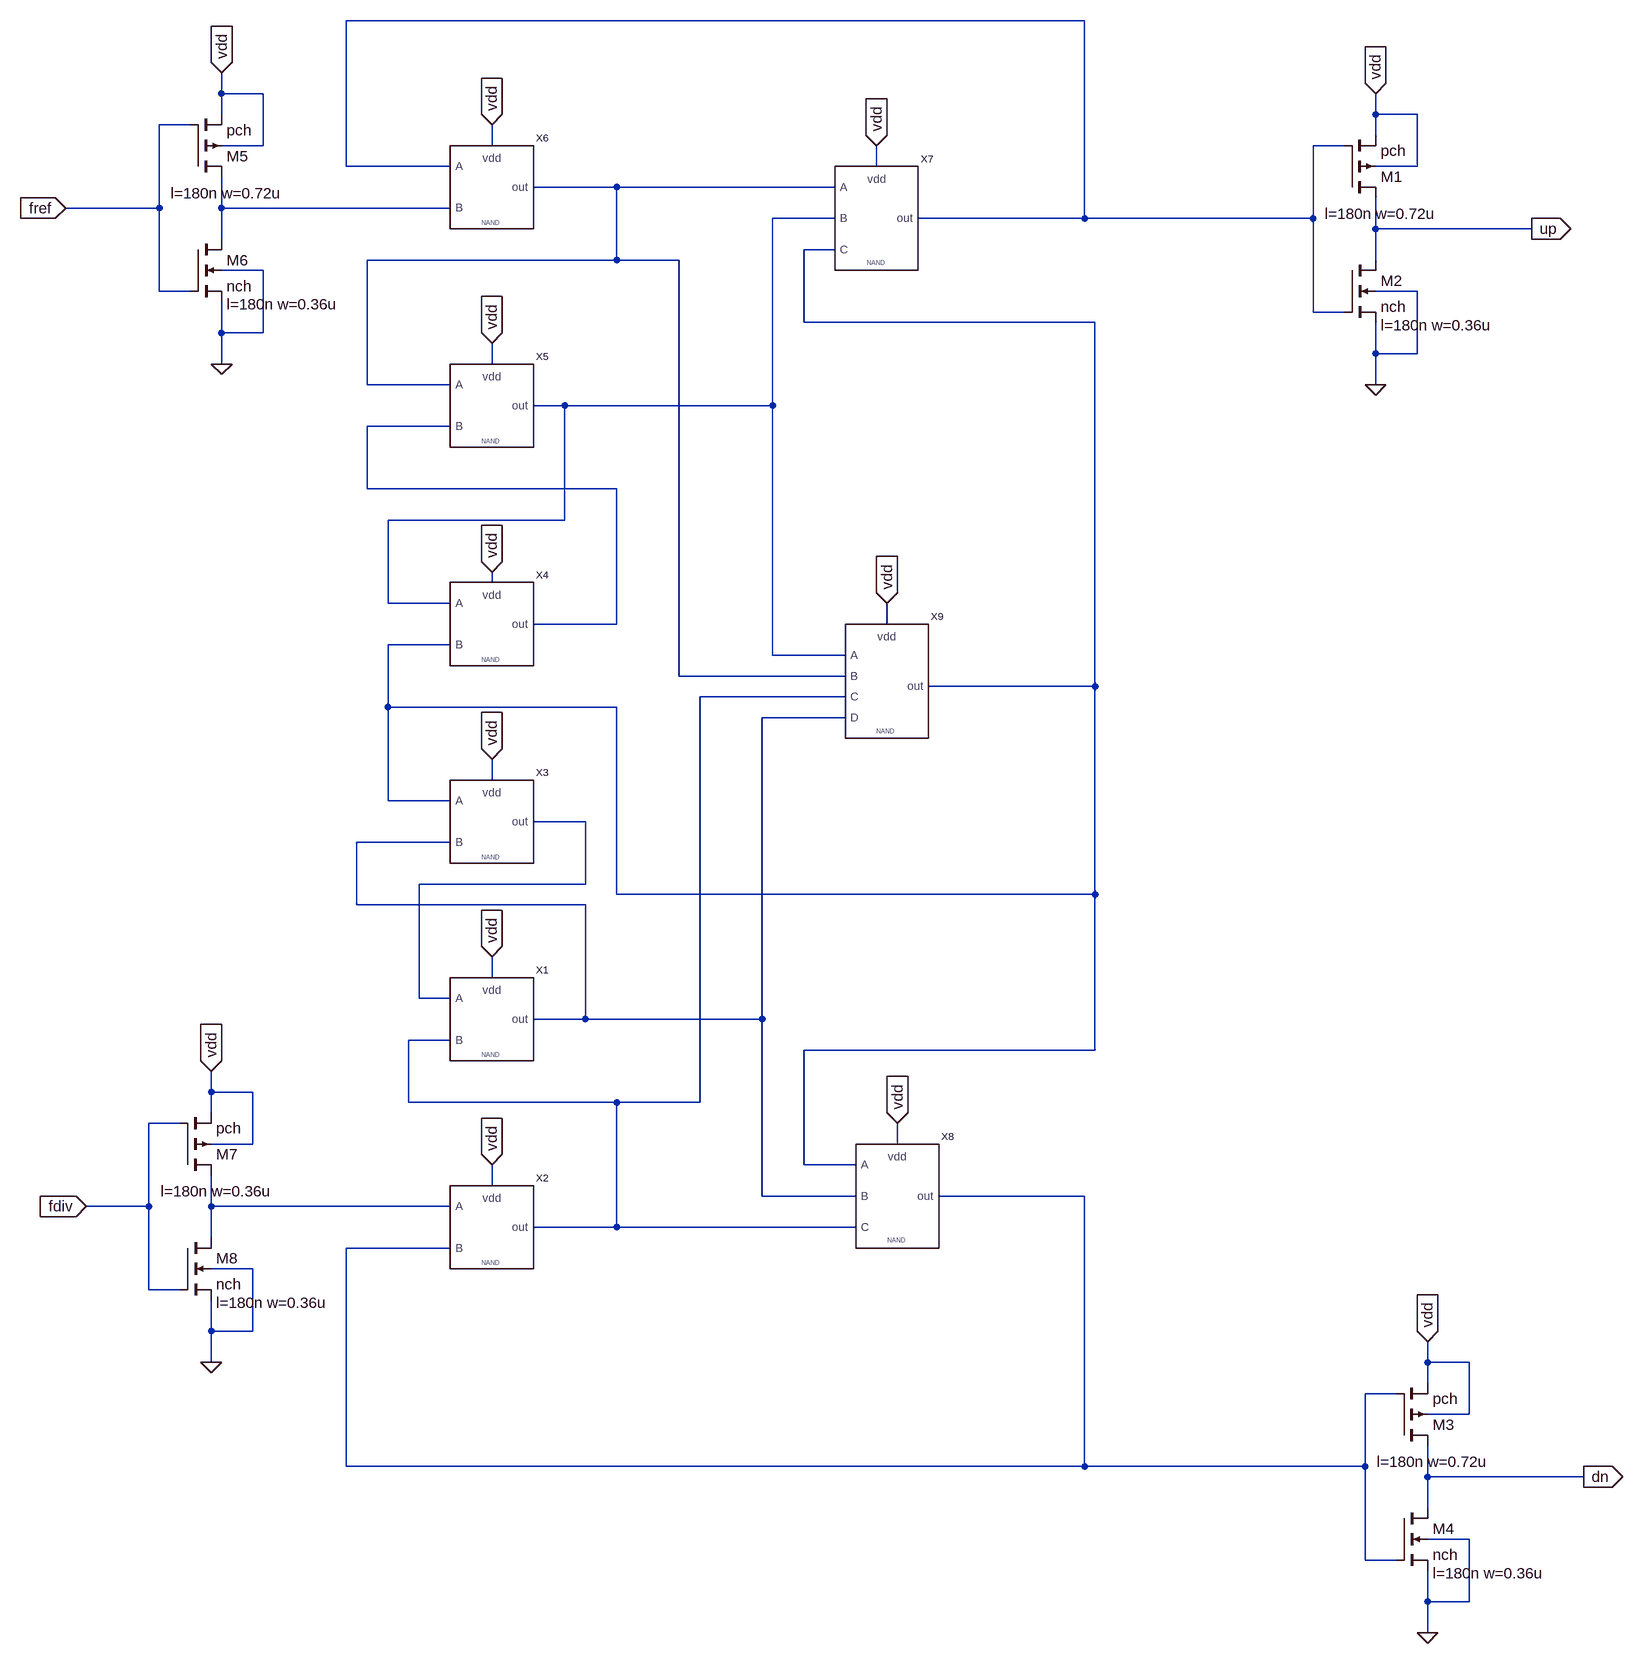
[diagram p0: schematic PFD_NAND.asc]
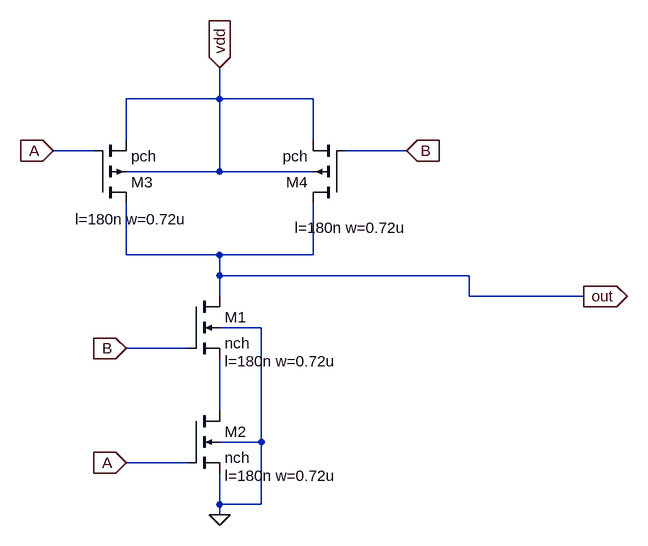
[diagram p1: sub-circuit nand_2.asc]
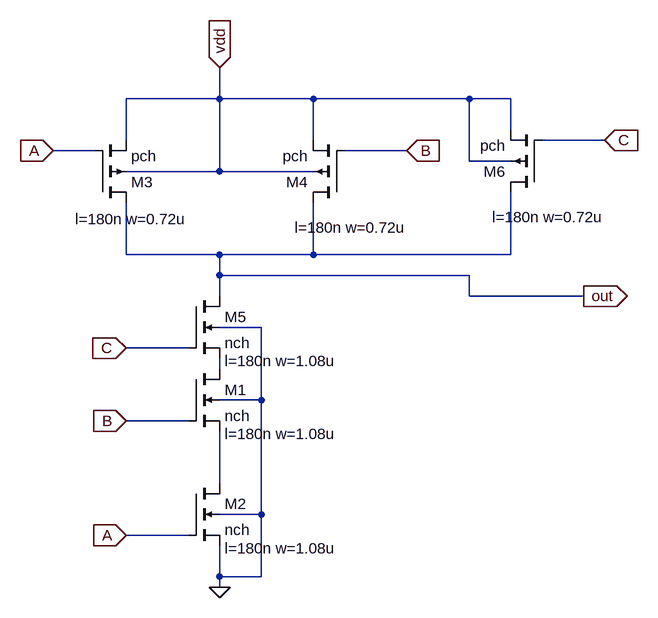
[diagram p2: sub-circuit nand_3.asc]
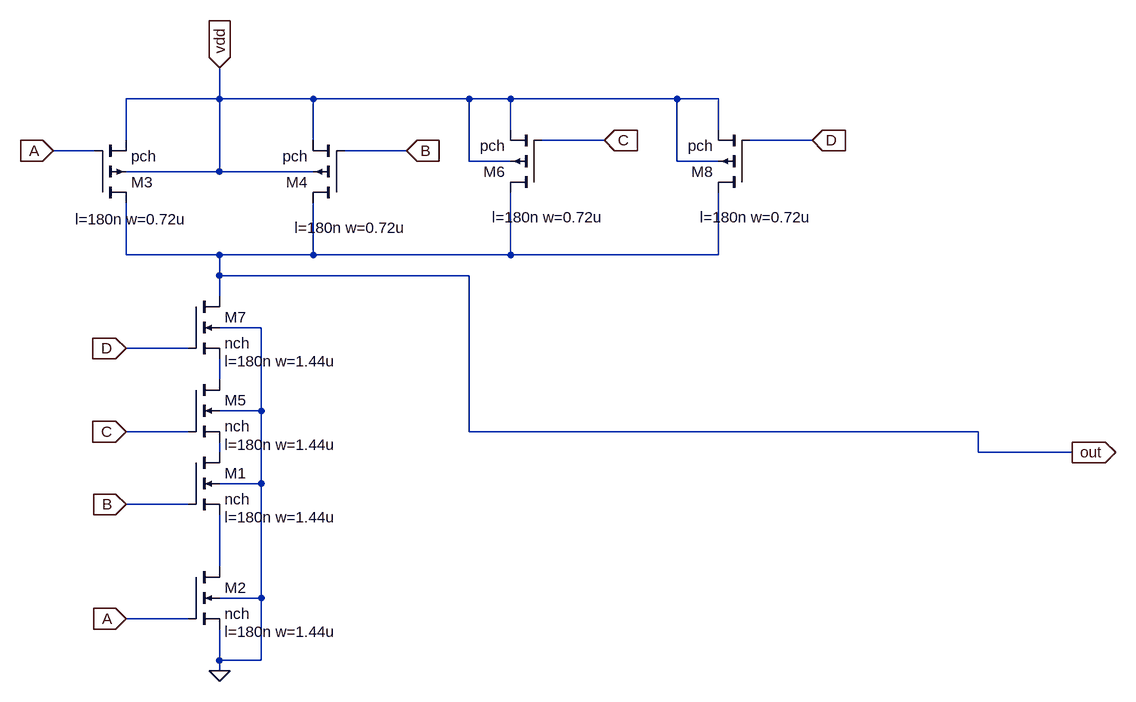
[diagram p3: sub-circuit nand_4.asc]
PFD_NAND.asc, the LTspice schematic file:
Version 4
SHEET 1 1908 1336
WIRE 1040 -1168 -96 -1168
WIRE -288 -1056 -288 -1088
WIRE -224 -1056 -288 -1056
WIRE -288 -1024 -288 -1056
WIRE 1488 -1024 1488 -1056
WIRE 1552 -1024 1488 -1024
WIRE -336 -1008 -384 -1008
WIRE 1488 -992 1488 -1024
WIRE -224 -976 -224 -1056
WIRE -224 -976 -288 -976
WIRE 128 -976 128 -1008
WIRE 1440 -976 1392 -976
WIRE -96 -944 -96 -1168
WIRE 64 -944 -96 -944
WIRE 720 -944 720 -976
WIRE 1552 -944 1552 -1024
WIRE 1552 -944 1488 -944
WIRE 320 -912 192 -912
WIRE 656 -912 320 -912
WIRE -384 -880 -384 -1008
WIRE -384 -880 -528 -880
WIRE -288 -880 -288 -928
WIRE 64 -880 -288 -880
WIRE 656 -864 560 -864
WIRE 1040 -864 1040 -1168
WIRE 1040 -864 784 -864
WIRE 1392 -864 1392 -976
WIRE 1392 -864 1040 -864
WIRE 1488 -848 1488 -896
WIRE 1728 -848 1488 -848
WIRE -288 -832 -288 -880
WIRE 656 -816 608 -816
WIRE 320 -800 320 -912
WIRE 320 -800 -64 -800
WIRE 416 -800 320 -800
WIRE 1488 -800 1488 -848
WIRE -224 -784 -288 -784
WIRE -384 -752 -384 -880
WIRE -336 -752 -384 -752
WIRE 1552 -752 1488 -752
WIRE 1392 -720 1392 -864
WIRE 1440 -720 1392 -720
WIRE 608 -704 608 -816
WIRE 1056 -704 608 -704
WIRE -288 -688 -288 -736
WIRE -224 -688 -224 -784
WIRE -224 -688 -288 -688
WIRE 1488 -656 1488 -704
WIRE 1552 -656 1552 -752
WIRE 1552 -656 1488 -656
WIRE -288 -640 -288 -688
WIRE 128 -640 128 -672
WIRE -64 -608 -64 -800
WIRE 64 -608 -64 -608
WIRE 1488 -608 1488 -656
WIRE 240 -576 192 -576
WIRE 560 -576 560 -864
WIRE 560 -576 240 -576
WIRE 64 -544 -64 -544
WIRE -64 -448 -64 -544
WIRE 320 -448 -64 -448
WIRE 240 -400 240 -576
WIRE 240 -400 -32 -400
WIRE 128 -304 128 -320
WIRE -32 -272 -32 -400
WIRE 64 -272 -32 -272
WIRE 320 -240 320 -448
WIRE 320 -240 192 -240
WIRE 736 -240 736 -272
WIRE 64 -208 -32 -208
WIRE 560 -192 560 -576
WIRE 672 -192 560 -192
WIRE 416 -160 416 -800
WIRE 672 -160 416 -160
WIRE 1056 -144 1056 -704
WIRE 1056 -144 800 -144
WIRE 672 -128 448 -128
WIRE -32 -112 -32 -208
WIRE 320 -112 -32 -112
WIRE 672 -96 544 -96
WIRE 128 0 128 -32
WIRE -32 32 -32 -112
WIRE 64 32 -32 32
WIRE 272 64 192 64
WIRE 64 96 -80 96
WIRE 272 160 272 64
WIRE 272 160 16 160
WIRE 320 176 320 -112
WIRE 1056 176 1056 -144
WIRE 1056 176 320 176
WIRE -80 192 -80 96
WIRE 272 192 -80 192
WIRE 128 304 128 272
WIRE 16 336 16 160
WIRE 64 336 16 336
WIRE 272 368 272 192
WIRE 272 368 192 368
WIRE 544 368 544 -96
WIRE 544 368 272 368
WIRE 64 400 0 400
WIRE 1056 416 1056 176
WIRE 1056 416 608 416
WIRE -304 480 -304 448
WIRE -240 480 -304 480
WIRE 0 496 0 400
WIRE 320 496 0 496
WIRE 448 496 448 -128
WIRE 448 496 320 496
WIRE -304 512 -304 480
WIRE -352 528 -400 528
WIRE -240 560 -240 480
WIRE -240 560 -304 560
WIRE 752 560 752 528
WIRE 608 592 608 416
WIRE 688 592 608 592
WIRE 128 624 128 592
WIRE 544 640 544 368
WIRE 688 640 544 640
WIRE 1040 640 816 640
WIRE -400 656 -400 528
WIRE -400 656 -496 656
WIRE -304 656 -304 608
WIRE 64 656 -304 656
WIRE 320 688 320 496
WIRE 320 688 192 688
WIRE 688 688 320 688
WIRE -304 704 -304 656
WIRE 64 720 -96 720
WIRE -240 752 -304 752
WIRE -400 784 -400 656
WIRE -352 784 -400 784
WIRE -304 848 -304 800
WIRE -240 848 -240 752
WIRE -240 848 -304 848
WIRE -304 896 -304 848
WIRE 1568 896 1568 864
WIRE 1632 896 1568 896
WIRE 1568 928 1568 896
WIRE 1520 944 1472 944
WIRE 1632 976 1632 896
WIRE 1632 976 1568 976
WIRE -96 1056 -96 720
WIRE 1040 1056 1040 640
WIRE 1040 1056 -96 1056
WIRE 1472 1056 1472 944
WIRE 1472 1056 1040 1056
WIRE 1568 1072 1568 1024
WIRE 1808 1072 1568 1072
WIRE 1568 1120 1568 1072
WIRE 1632 1168 1568 1168
WIRE 1472 1200 1472 1056
WIRE 1520 1200 1472 1200
WIRE 1568 1264 1568 1216
WIRE 1632 1264 1632 1168
WIRE 1632 1264 1568 1264
WIRE 1568 1312 1568 1264
FLAG 128 -1008 vdd
IOPIN 128 -1008 In
FLAG 128 -672 vdd
IOPIN 128 -672 In
FLAG 128 -320 vdd
IOPIN 128 -320 In
FLAG 128 -32 vdd
IOPIN 128 -32 In
FLAG 128 272 vdd
IOPIN 128 272 In
FLAG 128 592 vdd
IOPIN 128 592 In
FLAG 720 -976 vdd
IOPIN 720 -976 In
FLAG 736 -272 vdd
IOPIN 736 -272 In
FLAG 752 528 vdd
IOPIN 752 528 In
FLAG 1488 -1056 vdd
IOPIN 1488 -1056 In
FLAG 1488 -608 0
FLAG 1728 -848 up
IOPIN 1728 -848 Out
FLAG 1568 864 vdd
IOPIN 1568 864 In
FLAG 1568 1312 0
FLAG 1808 1072 dn
IOPIN 1808 1072 Out
FLAG -288 -1088 vdd
IOPIN -288 -1088 In
FLAG -288 -640 0
FLAG -528 -880 fref
IOPIN -528 -880 In
FLAG -304 448 vdd
IOPIN -304 448 In
FLAG -304 896 0
FLAG -496 656 fdiv
IOPIN -496 656 In
SYMBOL NAND_2 128 368 R0
SYMATTR InstName X1
SYMBOL NAND_2 128 688 R0
SYMATTR InstName X2
SYMBOL NAND_2 128 64 R0
SYMATTR InstName X3
SYMBOL NAND_2 128 -240 R0
SYMATTR InstName X4
SYMBOL NAND_2 128 -576 R0
SYMATTR InstName X5
SYMBOL NAND_2 128 -912 R0
SYMATTR InstName X6
SYMBOL NAND_3 720 -864 R0
SYMATTR InstName X7
SYMBOL NAND_3 752 640 R0
SYMATTR InstName X8
SYMBOL NAND_4 736 -144 R0
SYMATTR InstName X9
SYMBOL pmos4 1440 -896 M180
WINDOW 123 -30 -25 Left 2
SYMATTR Value2 l=180n w=0.72u
SYMATTR InstName M1
SYMATTR Value pch
SYMBOL nmos4 1440 -800 R0
WINDOW 123 56 100 Left 2
SYMATTR Value2 l=180n w=0.36u
SYMATTR InstName M2
SYMATTR Value nch
SYMBOL pmos4 1520 1024 M180
WINDOW 123 -30 -25 Left 2
SYMATTR Value2 l=180n w=0.72u
SYMATTR InstName M3
SYMATTR Value pch
SYMBOL nmos4 1520 1120 R0
WINDOW 123 56 100 Left 2
SYMATTR Value2 l=180n w=0.36u
SYMATTR InstName M4
SYMATTR Value nch
SYMBOL pmos4 -336 -928 M180
WINDOW 123 -30 -25 Left 2
SYMATTR Value2 l=180n w=0.72u
SYMATTR InstName M5
SYMATTR Value pch
SYMBOL nmos4 -336 -832 R0
WINDOW 123 56 100 Left 2
SYMATTR Value2 l=180n w=0.36u
SYMATTR InstName M6
SYMATTR Value nch
SYMBOL pmos4 -352 608 M180
WINDOW 123 -30 -25 Left 2
SYMATTR Value2 l=180n w=0.36u
SYMATTR InstName M7
SYMATTR Value pch
SYMBOL nmos4 -352 704 R0
WINDOW 123 56 100 Left 2
SYMATTR Value2 l=180n w=0.36u
SYMATTR InstName M8
SYMATTR Value nch

nand_2.asc, the sub-circuit schematic file:
Version 4
SHEET 1 1640 724
WIRE 544 64 544 16
WIRE 544 64 400 64
WIRE 688 64 544 64
WIRE 400 128 400 64
WIRE 688 128 688 64
WIRE 352 144 288 144
WIRE 832 144 736 144
WIRE 544 176 544 64
WIRE 544 176 400 176
WIRE 688 176 544 176
WIRE 400 304 400 224
WIRE 544 304 400 304
WIRE 688 304 688 224
WIRE 688 304 544 304
WIRE 544 336 544 304
WIRE 928 336 544 336
WIRE 544 368 544 336
WIRE 928 368 928 336
WIRE 1104 368 928 368
WIRE 608 416 544 416
WIRE 496 448 400 448
WIRE 544 544 544 464
WIRE 608 592 608 416
WIRE 608 592 544 592
WIRE 496 624 400 624
WIRE 544 688 544 640
WIRE 608 688 608 592
WIRE 608 688 544 688
WIRE 544 704 544 688
FLAG 1104 368 out
IOPIN 1104 368 Out
FLAG 544 704 0
FLAG 544 16 vdd
IOPIN 544 16 In
FLAG 288 144 A
IOPIN 288 144 In
FLAG 400 624 A
IOPIN 400 624 In
FLAG 400 448 B
IOPIN 400 448 In
FLAG 832 144 B
IOPIN 832 144 In
SYMBOL nmos4 496 544 R0
WINDOW 123 56 100 Left 2
SYMATTR Value2 l=180n w=0.72u
SYMATTR InstName M2
SYMATTR Value nch
SYMBOL nmos4 496 368 R0
WINDOW 123 56 100 Left 2
SYMATTR Value2 l=180n w=0.72u
SYMATTR InstName M1
SYMATTR Value nch
SYMBOL pmos4 352 224 M180
WINDOW 123 -30 -25 Left 2
SYMATTR Value2 l=180n w=0.72u
SYMATTR InstName M3
SYMATTR Value pch
SYMBOL pmos4 736 224 R180
WINDOW 123 -96 -38 Left 2
SYMATTR Value2 l=180n w=0.72u
SYMATTR InstName M4
SYMATTR Value pch

nand_3.asc, the sub-circuit schematic file:
Version 4
SHEET 1 1640 836
WIRE 544 64 544 16
WIRE 544 64 400 64
WIRE 688 64 544 64
WIRE 928 64 688 64
WIRE 992 64 928 64
WIRE 992 112 992 64
WIRE 400 128 400 64
WIRE 688 128 688 64
WIRE 1136 128 1040 128
WIRE 352 144 288 144
WIRE 832 144 736 144
WIRE 928 160 928 64
WIRE 992 160 928 160
WIRE 544 176 544 64
WIRE 544 176 400 176
WIRE 688 176 544 176
WIRE 400 304 400 224
WIRE 544 304 400 304
WIRE 688 304 688 224
WIRE 688 304 544 304
WIRE 992 304 992 208
WIRE 992 304 688 304
WIRE 544 336 544 304
WIRE 928 336 544 336
WIRE 544 368 544 336
WIRE 928 368 928 336
WIRE 1104 368 928 368
WIRE 608 416 544 416
WIRE 496 448 400 448
WIRE 544 480 544 464
WIRE 608 528 608 416
WIRE 608 528 544 528
WIRE 496 560 400 560
WIRE 544 656 544 576
WIRE 608 704 608 528
WIRE 608 704 544 704
WIRE 496 736 400 736
WIRE 544 800 544 752
WIRE 608 800 608 704
WIRE 608 800 544 800
WIRE 544 816 544 800
FLAG 1104 368 out
IOPIN 1104 368 Out
FLAG 544 816 0
FLAG 544 16 vdd
IOPIN 544 16 In
FLAG 288 144 A
IOPIN 288 144 In
FLAG 400 736 A
IOPIN 400 736 In
FLAG 400 560 B
IOPIN 400 560 In
FLAG 832 144 B
IOPIN 832 144 In
FLAG 400 448 C
IOPIN 400 448 In
FLAG 1136 128 C
IOPIN 1136 128 In
SYMBOL nmos4 496 656 R0
WINDOW 123 56 100 Left 2
SYMATTR Value2 l=180n w=1.08u
SYMATTR InstName M2
SYMATTR Value nch
SYMBOL nmos4 496 480 R0
WINDOW 123 56 100 Left 2
SYMATTR Value2 l=180n w=1.08u
SYMATTR InstName M1
SYMATTR Value nch
SYMBOL pmos4 352 224 M180
WINDOW 123 -30 -25 Left 2
SYMATTR Value2 l=180n w=0.72u
SYMATTR InstName M3
SYMATTR Value pch
SYMBOL pmos4 736 224 R180
WINDOW 123 -96 -38 Left 2
SYMATTR Value2 l=180n w=0.72u
SYMATTR InstName M4
SYMATTR Value pch
SYMBOL nmos4 496 368 R0
WINDOW 123 56 100 Left 2
SYMATTR Value2 l=180n w=1.08u
SYMATTR InstName M5
SYMATTR Value nch
SYMBOL pmos4 1040 208 R180
WINDOW 123 -96 -38 Left 2
SYMATTR Value2 l=180n w=0.72u
SYMATTR InstName M6
SYMATTR Value pch

nand_4.asc, the sub-circuit schematic file:
Version 4
SHEET 1 1952 964
WIRE 544 64 544 16
WIRE 544 64 400 64
WIRE 688 64 544 64
WIRE 928 64 688 64
WIRE 992 64 928 64
WIRE 1248 64 992 64
WIRE 1312 64 1248 64
WIRE 992 112 992 64
WIRE 1312 112 1312 64
WIRE 400 128 400 64
WIRE 688 128 688 64
WIRE 1136 128 1040 128
WIRE 1456 128 1360 128
WIRE 352 144 288 144
WIRE 832 144 736 144
WIRE 928 160 928 64
WIRE 992 160 928 160
WIRE 1248 160 1248 64
WIRE 1312 160 1248 160
WIRE 544 176 544 64
WIRE 544 176 400 176
WIRE 688 176 544 176
WIRE 400 304 400 224
WIRE 544 304 400 304
WIRE 688 304 688 224
WIRE 688 304 544 304
WIRE 992 304 992 208
WIRE 992 304 688 304
WIRE 1312 304 1312 208
WIRE 1312 304 992 304
WIRE 544 336 544 304
WIRE 928 336 544 336
WIRE 544 368 544 336
WIRE 608 416 544 416
WIRE 496 448 400 448
WIRE 544 496 544 464
WIRE 608 544 608 416
WIRE 608 544 544 544
WIRE 496 576 400 576
WIRE 928 576 928 336
WIRE 1712 576 928 576
WIRE 544 608 544 592
WIRE 1712 608 1712 576
WIRE 1856 608 1712 608
WIRE 608 656 608 544
WIRE 608 656 544 656
WIRE 496 688 400 688
WIRE 544 784 544 704
WIRE 608 832 608 656
WIRE 608 832 544 832
WIRE 496 864 400 864
WIRE 544 928 544 880
WIRE 608 928 608 832
WIRE 608 928 544 928
WIRE 544 944 544 928
FLAG 1856 608 out
IOPIN 1856 608 Out
FLAG 544 944 0
FLAG 544 16 vdd
IOPIN 544 16 In
FLAG 288 144 A
IOPIN 288 144 In
FLAG 400 864 A
IOPIN 400 864 In
FLAG 400 688 B
IOPIN 400 688 In
FLAG 832 144 B
IOPIN 832 144 In
FLAG 400 576 C
IOPIN 400 576 In
FLAG 1136 128 C
IOPIN 1136 128 In
FLAG 400 448 D
IOPIN 400 448 In
FLAG 1456 128 D
IOPIN 1456 128 In
SYMBOL nmos4 496 784 R0
WINDOW 123 56 100 Left 2
SYMATTR Value2 l=180n w=1.44u
SYMATTR InstName M2
SYMATTR Value nch
SYMBOL nmos4 496 608 R0
WINDOW 123 56 100 Left 2
SYMATTR Value2 l=180n w=1.44u
SYMATTR InstName M1
SYMATTR Value nch
SYMBOL pmos4 352 224 M180
WINDOW 123 -30 -25 Left 2
SYMATTR Value2 l=180n w=0.72u
SYMATTR InstName M3
SYMATTR Value pch
SYMBOL pmos4 736 224 R180
WINDOW 123 -96 -38 Left 2
SYMATTR Value2 l=180n w=0.72u
SYMATTR InstName M4
SYMATTR Value pch
SYMBOL nmos4 496 496 R0
WINDOW 123 56 100 Left 2
SYMATTR Value2 l=180n w=1.44u
SYMATTR InstName M5
SYMATTR Value nch
SYMBOL pmos4 1040 208 R180
WINDOW 123 -96 -38 Left 2
SYMATTR Value2 l=180n w=0.72u
SYMATTR InstName M6
SYMATTR Value pch
SYMBOL nmos4 496 368 R0
WINDOW 123 56 100 Left 2
SYMATTR Value2 l=180n w=1.44u
SYMATTR InstName M7
SYMATTR Value nch
SYMBOL pmos4 1360 208 R180
WINDOW 123 -96 -38 Left 2
SYMATTR Value2 l=180n w=0.72u
SYMATTR InstName M8
SYMATTR Value pch

The netlist it stands for:
* PFD_NAND.asc
XX1 N009 N007 vdd N008 nand_2
XX2 N011 N010 vdd N007 nand_2
XX3 N005 N008 vdd N009 nand_2
XX4 N004 N005 vdd N006 nand_2
XX5 N002 N006 vdd N004 nand_2
XX6 N001 N003 vdd N002 nand_2
XX7 N002 N004 N005 vdd N001 nand_3
XX8 N005 N008 N007 vdd N010 nand_3
XX9 N004 N002 N007 N008 vdd N005 nand_4
M1 up N001 vdd vdd pch l=180n w=0.72u
M2 up N001 0 0 nch l=180n w=0.36u
M3 dn N010 vdd vdd pch l=180n w=0.72u
M4 dn N010 0 0 nch l=180n w=0.36u
M5 N003 fref vdd vdd pch l=180n w=0.72u
M6 N003 fref 0 0 nch l=180n w=0.36u
M7 N011 fdiv vdd vdd pch l=180n w=0.36u
M8 N011 fdiv 0 0 nch l=180n w=0.36u

* block symbol definitions
.subckt nand_2 A B vdd out
M2 N001 A 0 0 nch l=180n w=0.72u
M1 out B N001 0 nch l=180n w=0.72u
M3 out A vdd vdd pch l=180n w=0.72u
M4 out B vdd vdd pch l=180n w=0.72u
.ends nand_2

.subckt nand_3 A B C vdd out
M2 N002 A 0 0 nch l=180n w=1.08u
M1 N001 B N002 0 nch l=180n w=1.08u
M3 out A vdd vdd pch l=180n w=0.72u
M4 out B vdd vdd pch l=180n w=0.72u
M5 out C N001 0 nch l=180n w=1.08u
M6 out C vdd vdd pch l=180n w=0.72u
.ends nand_3

.subckt nand_4 A B C D vdd out
M2 N003 A 0 0 nch l=180n w=1.44u
M1 N002 B N003 0 nch l=180n w=1.44u
M3 out A vdd vdd pch l=180n w=0.72u
M4 out B vdd vdd pch l=180n w=0.72u
M5 N001 C N002 0 nch l=180n w=1.44u
M6 out C vdd vdd pch l=180n w=0.72u
M7 out D N001 0 nch l=180n w=1.44u
M8 out D vdd vdd pch l=180n w=0.72u
.ends nand_4

.model NMOS NMOS
.model PMOS PMOS
.lib standard.mos
.backanno
.end